# EAGLE board A20-SOM-EVB_Rev_F (EAGLE 4.16), part 1 of 3
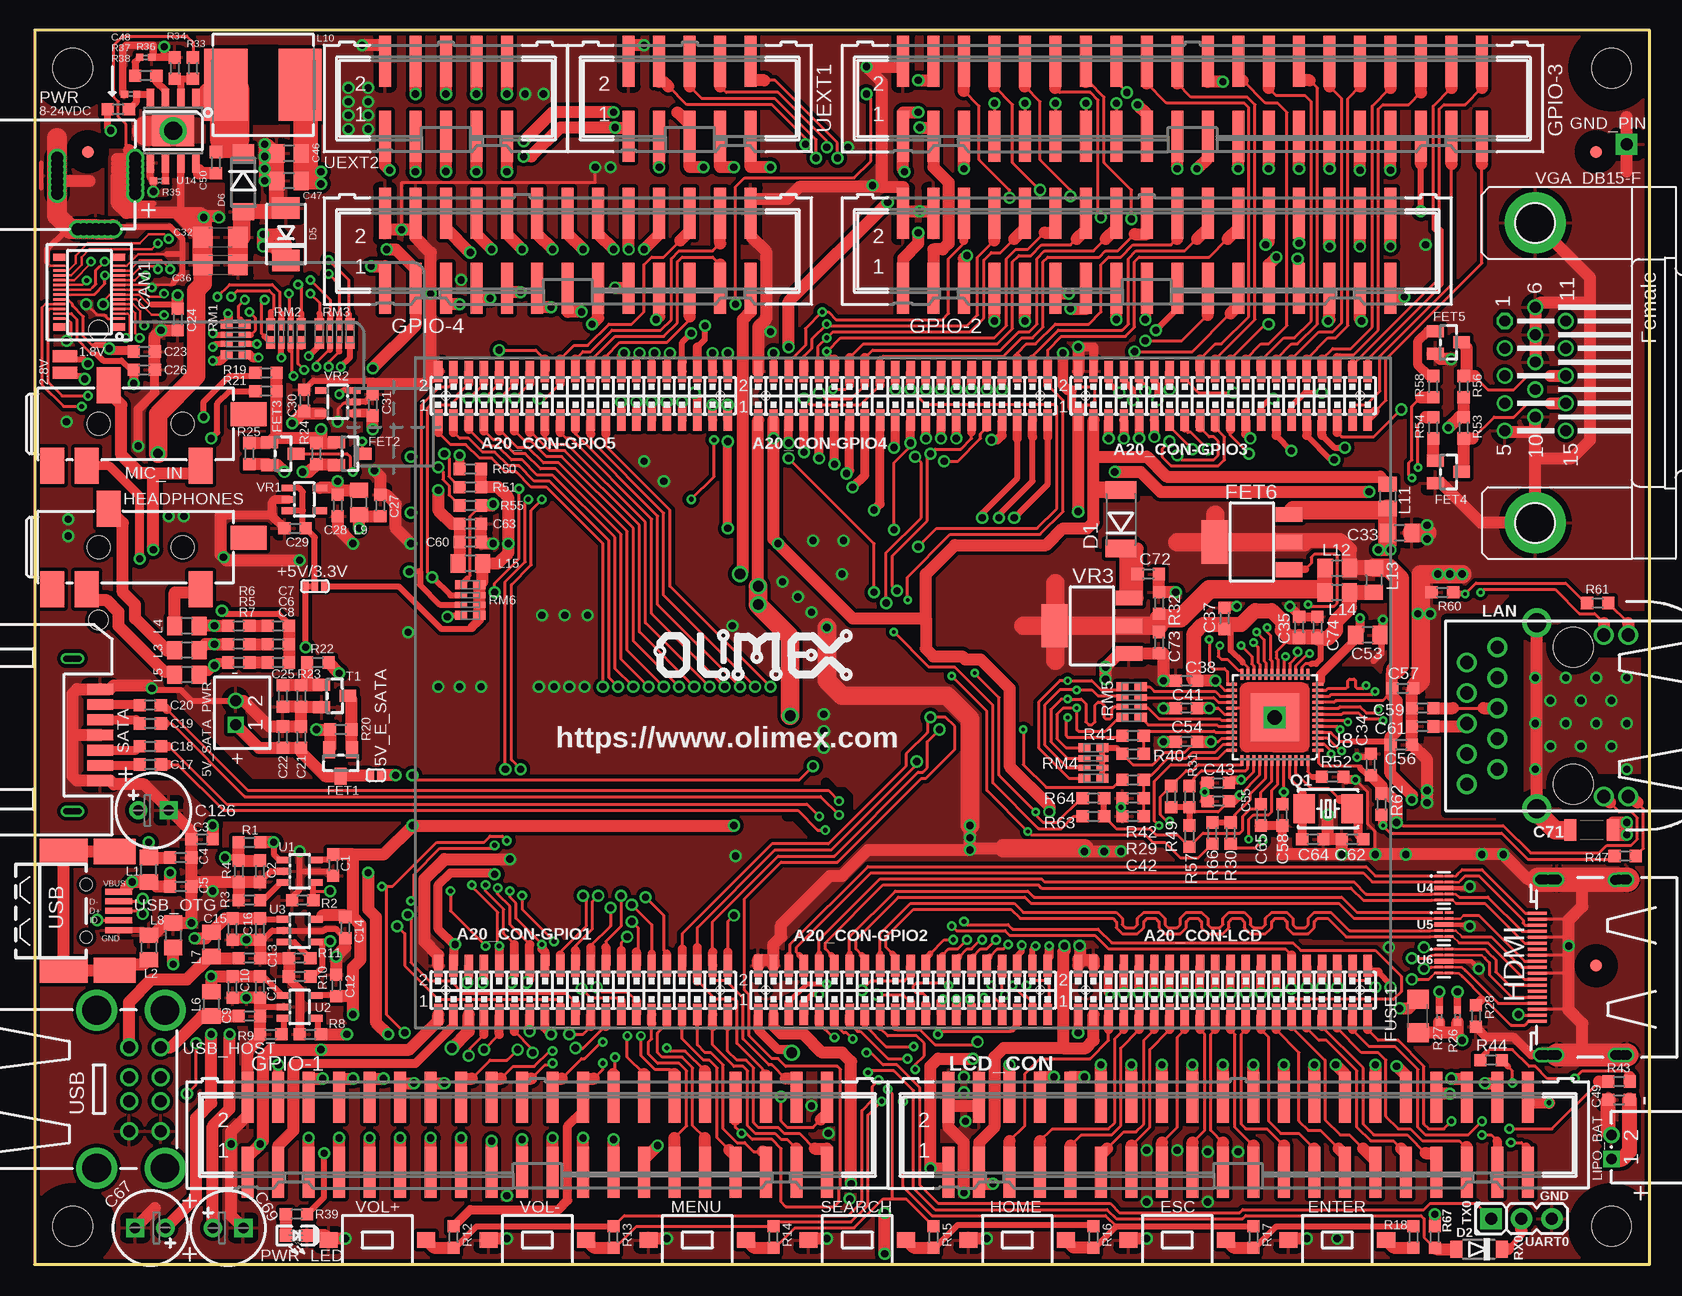
[diagram p5: board, top side]
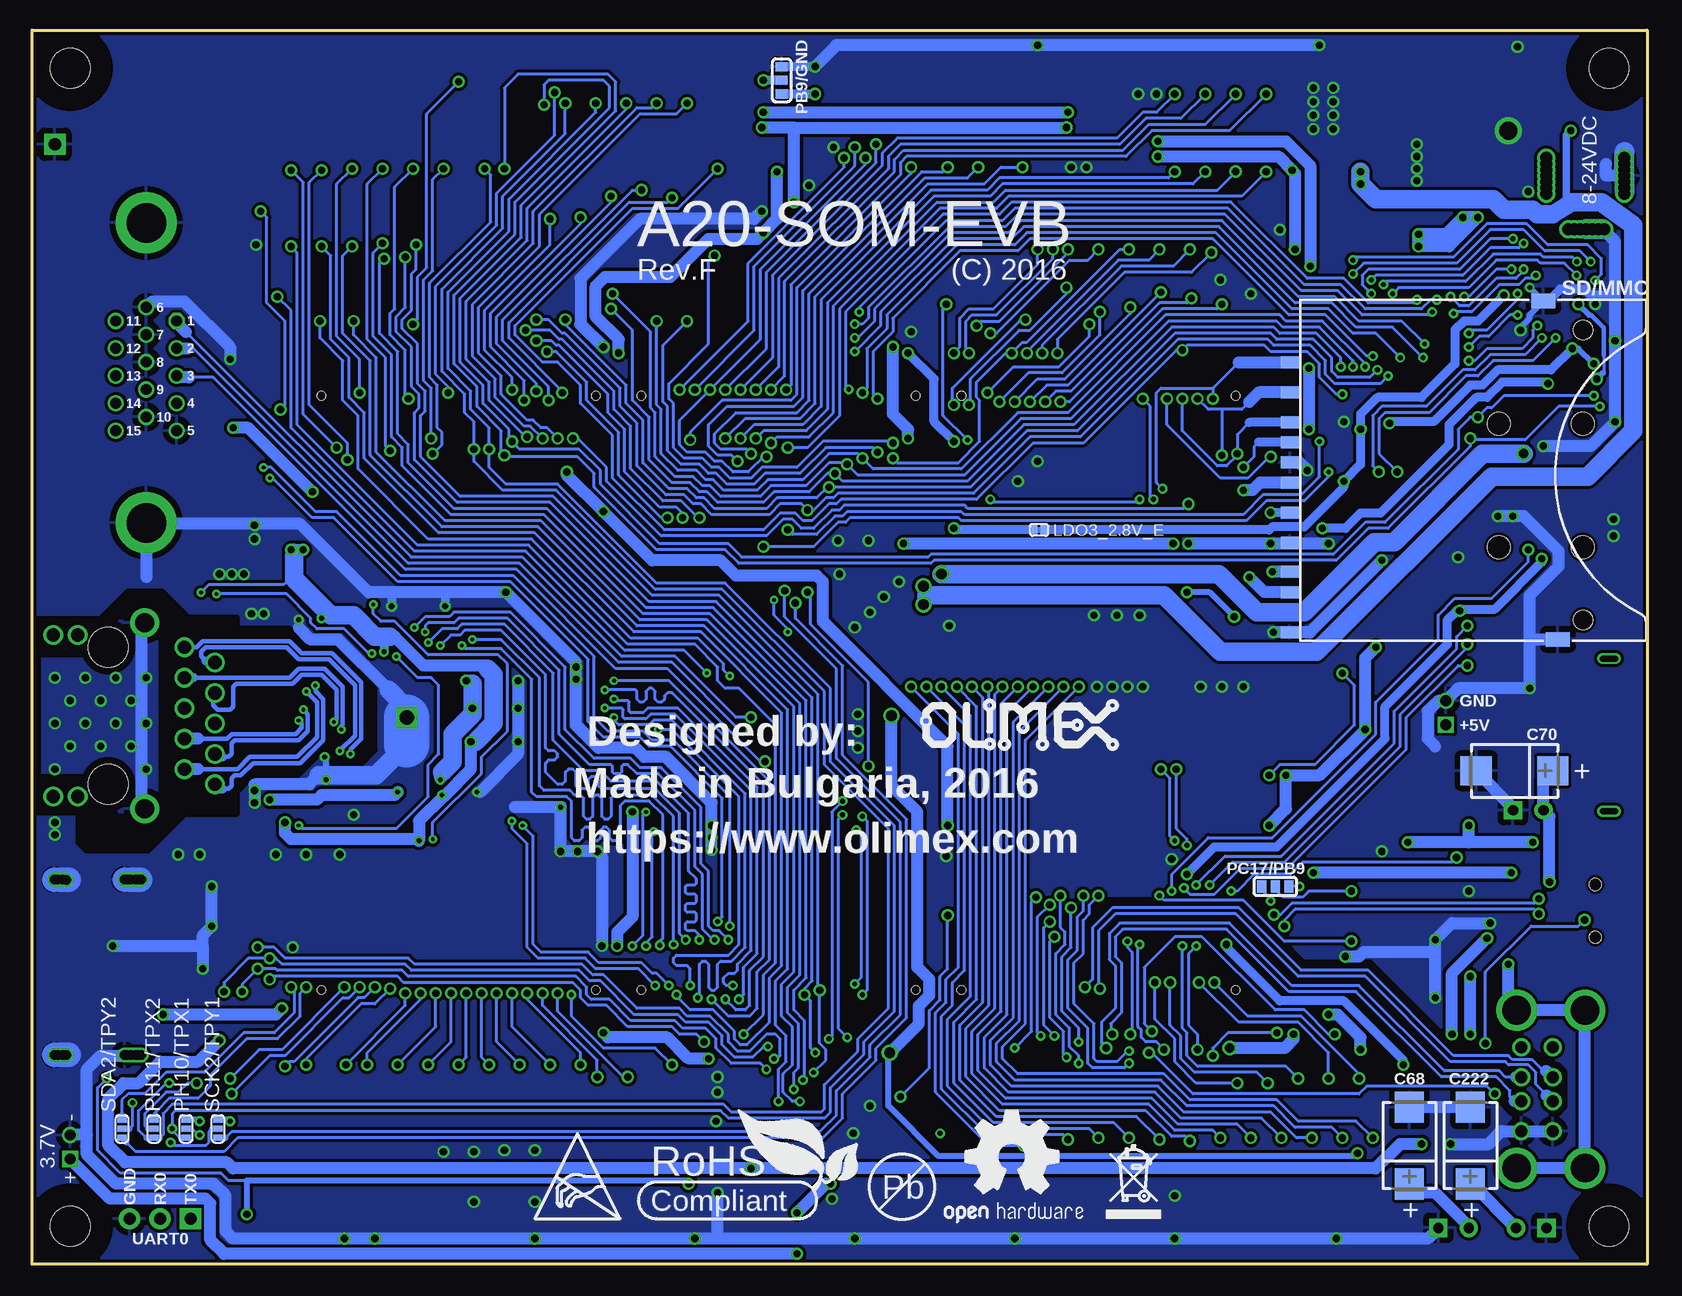
[diagram p6: board, bottom side, seen from below]

Size 134.62 x 102.87 mm. Coordinates in mm from the lower left corner, seen from the top.
Outline: 0,102.87 0,0 134.62,0 134.62,102.87 0,102.87
Copper layers (1+16): Top 0.035mm / dielectric 1.5mm / Bottom 0.035mm
Design rules "default": minimum track width 8mil, minimum drill 0.4mm, track to track 5mil, track to pad 5mil, pad to pad 5mil, via to via 5mil, smd to smd 1mil, copper to edge 10mil, drill to drill 8mil, minimum pad ring 8mil, minimum via ring 8mil, stop-mask expansion 4mil, vias tented up to drill 25mil, thermal gap 20mil
Holes 3.3 mm at 3.17,3.17 131.44,3.17 131.44,99.69 3.17,99.69
tRestrict: area 0,0 to 6.3,6.3; area 128.3,0 to 134.6,6.3; area 128.3,96.5 to 134.6,102.9; area 0,96.5 to 6.3,102.9; 51 lines
bRestrict: area 0,0 to 6.3,6.3; area 128.3,0 to 134.6,6.3; area 128.3,96.5 to 134.6,102.9; area 0,96.5 to 6.3,102.9; 43 lines

## Footprints (pad centres in the part's own frame; a part is rotated, then mirrored left to right if it is on the bottom)
SMD80/40 = smd 2.032 x 1.016: P$1 0,0
SJ_1_SMALLER = smd 0.508 x 0.762: 1 -0.381,0; 2 0.381,0
DW02S = drill 0.9 square: 1 -1,0 | drill 0.9 round: 2 1,0
SJ_2_SMALLER_23_TIED = smd 0.508 x 0.762: 1 -0.762,0; 2 0,0; 3 0.762,0
A20-SOM-EVB = smd 0.7 x 1.8: 1-1 -38.735,-26.797; 1-2 -38.735,-22.733; 1-3 -37.465,-26.797; 1-4 -37.465,-22.733; 1-5 -36.195,-26.797; 1-6 -36.195,-22.733; 1-7 -34.925,-26.797; 1-8 -34.925,-22.733; 1-9 -33.655,-26.797; 1-10 -33.655,-22.733; 1-11 -32.385,-26.797; 1-12 -32.385,-22.733; 1-13 -31.115,-26.797; 1-14 -31.115,-22.733; 1-15 -29.845,-26.797; 1-16 -29.845,-22.733; 1-17 -28.575,-26.797; 1-18 -28.575,-22.733; 1-19 -27.305,-26.797; 1-20 -27.305,-22.733; 1-21 -26.035,-26.797; 1-22 -26.035,-22.733; 1-23 -24.765,-26.797; 1-24 -24.765,-22.733; 1-25 -23.495,-26.797; 1-26 -23.495,-22.733; 1-27 -22.225,-26.797; 1-28 -22.225,-22.733; 1-29 -20.955,-26.797; 1-30 -20.955,-22.733; 1-31 -19.685,-26.797; 1-32 -19.685,-22.733; 1-33 -18.415,-26.797; 1-34 -18.415,-22.733; 1-35 -17.145,-26.797; 1-36 -17.145,-22.733; 1-37 -15.875,-26.797; 1-38 -15.875,-22.733; 1-39 -14.605,-26.797; 1-40 -14.605,-22.733; 2-1 -12.065,-26.797; 2-2 -12.065,-22.733; 2-3 -10.795,-26.797; 2-4 -10.795,-22.733; 2-5 -9.525,-26.797; 2-6 -9.525,-22.733; 2-7 -8.255,-26.797; 2-8 -8.255,-22.733; 2-9 -6.985,-26.797; 2-10 -6.985,-22.733; 2-11 -5.715,-26.797; 2-12 -5.715,-22.733; 2-13 -4.445,-26.797; 2-14 -4.445,-22.733; 2-15 -3.175,-26.797; 2-16 -3.175,-22.733; 2-17 -1.905,-26.797; 2-18 -1.905,-22.733; 2-19 -0.635,-26.797; 2-20 -0.635,-22.733; 2-21 0.635,-26.797; 2-22 0.635,-22.733; 2-23 1.905,-26.797; 2-24 1.905,-22.733; 2-25 3.175,-26.797; 2-26 3.175,-22.733; 2-27 4.445,-26.797; 2-28 4.445,-22.733; 2-29 5.715,-26.797; 2-30 5.715,-22.733; 2-31 6.985,-26.797; 2-32 6.985,-22.733; 2-33 8.255,-26.797; 2-34 8.255,-22.733; 2-35 9.525,-26.797; 2-36 9.525,-22.733; 2-37 10.795,-26.797; 2-38 10.795,-22.733; 2-39 12.065,-26.797; 2-40 12.065,-22.733; 3-1 14.605,22.733; 3-2 14.605,26.797; 3-3 15.875,22.733; 3-4 15.875,26.797; 3-5 17.145,22.733; 3-6 17.145,26.797; 3-7 18.415,22.733; 3-8 18.415,26.797; 3-9 19.685,22.733; 3-10 19.685,26.797; 3-11 20.955,22.733; 3-12 20.955,26.797; 3-13 22.225,22.733; 3-14 22.225,26.797; 3-15 23.495,22.733; 3-16 23.495,26.797; 3-17 24.765,22.733; 3-18 24.765,26.797; 3-19 26.035,22.733; 3-20 26.035,26.797; 3-21 27.305,22.733; 3-22 27.305,26.797; 3-23 28.575,22.733; 3-24 28.575,26.797; 3-25 29.845,22.733; 3-26 29.845,26.797; 3-27 31.115,22.733; 3-28 31.115,26.797; 3-29 32.385,22.733; 3-30 32.385,26.797; 3-31 33.655,22.733; 3-32 33.655,26.797; 3-33 34.925,22.733; 3-34 34.925,26.797; 3-35 36.195,22.733; 3-36 36.195,26.797; 3-37 37.465,22.733; 3-38 37.465,26.797; 3-39 38.735,22.733; 3-40 38.735,26.797; 4-1 -12.065,22.733; 4-2 -12.065,26.797; 4-3 -10.795,22.733; 4-4 -10.795,26.797; 4-5 -9.525,22.733; 4-6 -9.525,26.797; 4-7 -8.255,22.733; 4-8 -8.255,26.797; 4-9 -6.985,22.733; 4-10 -6.985,26.797; 4-11 -5.715,22.733; 4-12 -5.715,26.797; 4-13 -4.445,22.733; 4-14 -4.445,26.797; 4-15 -3.175,22.733; 4-16 -3.175,26.797; 4-17 -1.905,22.733; 4-18 -1.905,26.797; 4-19 -0.635,22.733; 4-20 -0.635,26.797; 4-21 0.635,22.733; 4-22 0.635,26.797; 4-23 1.905,22.733; 4-24 1.905,26.797; 4-25 3.175,22.733; 4-26 3.175,26.797; 4-27 4.445,22.733; 4-28 4.445,26.797; 4-29 5.715,22.733; 4-30 5.715,26.797; 4-31 6.985,22.733; 4-32 6.985,26.797; 4-33 8.255,22.733; 4-34 8.255,26.797; 4-35 9.525,22.733; 4-36 9.525,26.797; 4-37 10.795,22.733; 4-38 10.795,26.797; 4-39 12.065,22.733; 4-40 12.065,26.797; 5-1 -38.735,22.733; 5-2 -38.735,26.797; 5-3 -37.465,22.733; 5-4 -37.465,26.797; 5-5 -36.195,22.733; 5-6 -36.195,26.797; 5-7 -34.925,22.733; 5-8 -34.925,26.797; 5-9 -33.655,22.733; 5-10 -33.655,26.797; 5-11 -32.385,22.733; 5-12 -32.385,26.797; 5-13 -31.115,22.733; 5-14 -31.115,26.797; 5-15 -29.845,22.733; 5-16 -29.845,26.797; 5-17 -28.575,22.733; 5-18 -28.575,26.797; 5-19 -27.305,22.733; 5-20 -27.305,26.797; 5-21 -26.035,22.733; 5-22 -26.035,26.797; 5-23 -24.765,22.733; 5-24 -24.765,26.797; 5-25 -23.495,22.733; 5-26 -23.495,26.797; 5-27 -22.225,22.733; 5-28 -22.225,26.797; 5-29 -20.955,22.733; 5-30 -20.955,26.797; 5-31 -19.685,22.733; 5-32 -19.685,26.797; 5-33 -18.415,22.733; 5-34 -18.415,26.797; 5-35 -17.145,22.733; 5-36 -17.145,26.797; 5-37 -15.875,22.733; 5-38 -15.875,26.797; 5-39 -14.605,22.733; 5-40 -14.605,26.797; LCD-1 14.605,-26.797; LCD-2 14.605,-22.733; LCD-3 15.875,-26.797; LCD-4 15.875,-22.733; LCD-5 17.145,-26.797; LCD-6 17.145,-22.733; LCD-7 18.415,-26.797; LCD-8 18.415,-22.733; LCD-9 19.685,-26.797; LCD-10 19.685,-22.733; LCD-11 20.955,-26.797; LCD-12 20.955,-22.733; LCD-13 22.225,-26.797; LCD-14 22.225,-22.733; LCD-15 23.495,-26.797; LCD-16 23.495,-22.733; LCD-17 24.765,-26.797; LCD-18 24.765,-22.733; LCD-19 26.035,-26.797; LCD-20 26.035,-22.733; LCD-21 27.305,-26.797; LCD-22 27.305,-22.733; LCD-23 28.575,-26.797; LCD-24 28.575,-22.733; LCD-25 29.845,-26.797; LCD-26 29.845,-22.733; LCD-27 31.115,-26.797; LCD-28 31.115,-22.733; LCD-29 32.385,-26.797; LCD-30 32.385,-22.733; LCD-31 33.655,-26.797; LCD-32 33.655,-22.733; LCD-33 34.925,-26.797; LCD-34 34.925,-22.733; LCD-35 36.195,-26.797; LCD-36 36.195,-22.733; LCD-37 37.465,-26.797; LCD-38 37.465,-22.733; LCD-39 38.735,-26.797; LCD-40 38.735,-22.733 | hole 0.7: -38.1,-24.765; -15.24,-24.765; -11.43,24.765; 11.43,24.765; 15.24,24.765; 38.1,24.765; -11.43,-24.765; 11.43,-24.765; -38.1,24.765; -15.24,24.765; 15.24,-24.765; 38.1,-24.765
C0603_DWS = smd 1.016 x 1.016: 1 -0.889,0; 2 0.889,0
C1206_5MIL_WS = smd 1.651 x 1.778: 1 -1.46,0; 2 1.46,0
C0805_5MIL_DWS = smd 1.27 x 1.524: 1 -1.016,0; 2 1.016,0
E2,5-6,3 = drill 0.864 pad 1.524 round: + -1.27,0 | drill 0.864 pad 1.524 square: - 1.27,0
CT7343 = smd 2.6 x 2.4: + 3.2,0; - -3.2,0
C1206_5MILS_WS_ISO = smd 1.016 x 1.778: 1 -1.778,0; 2 1.778,0
CAM_2M_GT2005 = smd 0.2 x 1: 1 -2.2,-2.5; 2 -2.2,2.5; 3 -1.8,-2.5; 4 -1.8,2.5; 5 -1.4,-2.5; 6 -1.4,2.5; 7 -1,-2.5; 8 -1,2.5; 9 -0.6,-2.5; 10 -0.6,2.5; 11 -0.2,-2.5; 12 -0.2,2.5; 13 0.2,-2.5; 14 0.2,2.5; 15 0.6,-2.5; 16 0.6,2.5; 17 1,-2.5; 18 1,2.5; 19 1.4,-2.5; 20 1.4,2.5; 21 1.8,-2.5; 22 1.8,2.5; 23 2.2,-2.5; 24 2.2,2.5 | smd 0.6 x 1: MP1 -2.9,-2.5; MP2 -2.9,2.5; MP3 2.9,-2.5; MP4 2.9,2.5
MELF-MLL41 = smd 1.45 x 2.6: 1 -2.445,0; 2 2.445,0
SOD-123 = smd 1 x 1.4: A 1.9,0; C -1.9,0
DO214AA = smd 1.778 x 2.286: A 2.177,0; C -2.177,0
MLL-41 = smd 1.45 x 1.8: A 2.445,0; K -2.445,0
SW-TAKT_6X3.5_SMD = smd 1.27 x 1.524: P$1 0,4.064; P$2 0,-4.064
SOT23 = smd 1.4 x 1: 1 1.1,-0.95; 2 1.1,0.95; 3 -1.1,0
SOT223 = smd 2.235 x 1.219: 1 3.099,-2.311; 2 3.099,0; 3 3.099,2.311 | smd 2.2 x 3.6: 4 -3.099,0
FIDUCIAL-1X3 = smd 1 x 1: 1 0,0
1206 = smd 1.6 x 1.8: 1 -1.4,0; 2 1.4,0
TEST_PAD40/70/SQUARE = drill 1.016 pad 1.778 square: P$1 0,0
ML40-MALE(GBH-254-SMT-40) = smd 1 x 4.25: 1 -24.13,-3.125; 2 -24.13,3.125; 3 -21.59,-3.125; 4 -21.59,3.125; 5 -19.05,-3.125; 6 -19.05,3.125; 7 -16.51,-3.125; 8 -16.51,3.125; 9 -13.97,-3.125; 10 -13.97,3.125; 11 -11.43,-3.125; 12 -11.43,3.125; 13 -8.89,-3.125; 14 -8.89,3.125; 15 -6.35,-3.125; 16 -6.35,3.125; 17 -3.81,-3.125; 18 -3.81,3.125; 19 -1.27,-3.125; 20 -1.27,3.125; 21 1.27,-3.125; 22 1.27,3.125; 23 3.81,-3.125; 24 3.81,3.125; 25 6.35,-3.125; 26 6.35,3.125; 27 8.89,-3.125; 28 8.89,3.125; 29 11.43,-3.125; 30 11.43,3.125; 31 13.97,-3.125; 32 13.97,3.125; 33 16.51,-3.125; 34 16.51,3.125; 35 19.05,-3.125; 36 19.05,3.125; 37 21.59,-3.125; 38 21.59,3.125; 39 24.13,-3.125; 40 24.13,3.125
ML34-MALE(GBH-254-SMT-34) = smd 1 x 4.25: 1 -20.32,-3.125; 2 -20.32,3.125; 3 -17.78,-3.125; 4 -17.78,3.125; 5 -15.24,-3.125; 6 -15.24,3.125; 7 -12.7,-3.125; 8 -12.7,3.125; 9 -10.16,-3.125; 10 -10.16,3.125; 11 -7.62,-3.125; 12 -7.62,3.125; 13 -5.08,-3.125; 14 -5.08,3.125; 15 -2.54,-3.125; 16 -2.54,3.125; 17 0,-3.125; 18 0,3.125; 19 2.54,-3.125; 20 2.54,3.125; 21 5.08,-3.125; 22 5.08,3.125; 23 7.62,-3.125; 24 7.62,3.125; 25 10.16,-3.125; 26 10.16,3.125; 27 12.7,-3.125; 28 12.7,3.125; 29 15.24,-3.125; 30 15.24,3.125; 31 17.78,-3.125; 32 17.78,3.125; 33 20.32,-3.125; 34 20.32,3.125
ML26-MALE(GBH-254-SMT-26) = smd 1 x 4.25: 1 -15.24,-3.125; 2 -15.24,3.125; 3 -12.7,-3.125; 4 -12.7,3.125; 5 -10.16,-3.125; 6 -10.16,3.125; 7 -7.62,-3.125; 8 -7.62,3.125; 9 -5.08,-3.125; 10 -5.08,3.125; 11 -2.54,-3.125; 12 -2.54,3.125; 13 0,-3.125; 14 0,3.125; 15 2.54,-3.125; 16 2.54,3.125; 17 5.08,-3.125; 18 5.08,3.125; 19 7.62,-3.125; 20 7.62,3.125; 21 10.16,-3.125; 22 10.16,3.125; 23 12.7,-3.125; 24 12.7,3.125; 25 15.24,-3.125; 26 15.24,3.125
HDMI-SWM-19 = smd 0.25 x 1.6: 1 -4.5,-5.55; 2 -4,-5.55; 3 -3.5,-5.55; 4 -3,-5.55; 5 -2.5,-5.55; 6 -2,-5.55; 7 -1.5,-5.55; 8 -1,-5.55; 9 -0.5,-5.55; 10 0,-5.55; 11 0.5,-5.55; 12 1,-5.55; 13 1.5,-5.55; 14 2,-5.55; 15 2.5,-5.55; 16 3,-5.55; 17 3.5,-5.55; 18 4,-5.55; 19 4.5,-5.55 | drill 0.8 round: P$5 -7.3,-4.85; P$7 -7.3,1.25; P$9 7.3,1.25; P$11 7.3,-4.85; P$13 -7.3,-4.45; P$15 -7.3,1.65; P$18 7.3,1.65; P$20 7.3,-4.45; P$21 -7.3,-4.15; P$22 -7.3,-5; P$23 7.3,-5; P$24 7.3,-4.15; P$25 -7.3,-5.3; P$26 7.3,-5.3; P$27 7.3,0.95; P$28 -7.275,0.95; SH1 -7.3,-3.9; SH2 -7.3,1.95; SH3 7.3,1.95; SH4 7.3,-3.9
PJ-W47S-05D2-LF_5PIN_V2 = smd 2 x 3: 1 2.1,-0.5; 2 14.5,-0.5; 3 6.8,6.2; 5 5,-0.5 | smd 3 x 2: 4 18.5,3.8 | hole 1.9: 6,3; 13,3
L0805_5MIL_DWS = smd 1.27 x 1.524: 1 -1.016,0; 2 1.016,0
8X8MM_3131 = smd 3.6 x 6: 1 -3.1,0; 2 3.1,0
TM211Q01FM22_SH = drill 1.1 round: 1 -5.715,-6.35; 2 -4.445,-8.89; 3 -3.175,-6.35; 4 -1.905,-8.89; 5 -0.635,-6.35; 6 0.635,-8.89; 7 1.905,-6.35; 8 3.175,-8.89; 9 4.445,-6.35; 10 5.715,-8.89; 11 -6.731,2.54; 12 -6.731,4.572; 13 6.731,2.54; 14 6.731,4.572 | drill 1.6 round: SH1 -7.747,-3.048; SH2 7.747,-3.048 | hole 3.3: 5.715,0; -5.715,0
SJ_1_SMALLER_CLOSE = smd 0.508 x 0.762: 1 -0.381,0; 2 0.381,0
DW02R = drill 0.9 square: 1 -1,0 | drill 0.9 round: 2 1,0
SJ_2_SMALL = smd 0.762 x 1.016: 1 -1.143,0; 2 0,0; 3 1.143,0
SJ_2_SMALLER = smd 0.508 x 0.762: 1 -0.762,0; 2 0,0; 3 0.762,0
PWR_JACK_UNI_MILLING = drill 1 round: + 0,4.75; +1 0,5.25; +2 0,5.75; +3 0,6.25; +4 0,4.25; +5 0,3.75; +6 0,3.25; - -6.5,4.75; -1 -6.5,5.25; -2 -6.5,5.75; -3 -6.5,4.25; -4 -6.5,3.75; -5 -6.5,6.25; -6 -6.5,3.25; -- -3.3,0.3; --1 -3.8,0.3; --2 -4.3,0.3; --3 -4.8,0.3; --4 -2.8,0.3; --5 -2.3,0.3; --6 -1.8,0.3
LED-0603 = smd 1.016 x 1.016: A 0.889,0; C -0.889,0
HCX-4S = smd 1.8 x 2.4: 1 -2,0; 2 2,0
R0603_5MIL_DWS = smd 1.016 x 1.016: 1 -0.889,0; 2 0.889,0
R0402_TI = smd 0.61 x 0.584: 1 -0.508,0; 2 0.508,0
R_MATRIX_4 = smd 0.762 x 1.016: 1.1 -1.27,-0.762; 1.2 -1.27,0.762; 4.1 1.27,-0.762; 4.2 1.27,0.762 | smd 0.508 x 1.016: 2.1 -0.381,-0.762; 2.2 -0.381,0.762; 3.1 0.381,-0.762; 3.2 0.381,0.762
SATA-PWA-07 = smd 0.9 x 2.2: 1 -4.25,-4.8; 2 -2.98,-4.8; 3 -1.71,-4.8; 4 -0.44,-4.8; 5 0.83,-4.8; 6 2.1,-4.8; 7 3.37,-4.8 | drill 0.5 round: P$1 -6.81,-2.35; P$2 -6.81,-2.15; P$3 -6.81,-2.6; P$4 -6.81,-1.95; P$5 -6.81,-3; P$11 5.93,-2.35; P$20 5.93,-2.15; P$23 5.93,-2.6; P$24 5.93,-1.95; P$26 5.93,-3; SH1 -6.81,-2.8; SH4 5.93,-2.8
SD_CARD = smd 1.5 x 1: 1 -15.3,6.48; 2 -15.3,3.98; 3 -15.3,0.68; 4 -15.3,-1.03; 5 -15.3,-3.53; 6 -15.3,-6.03; 7 -15.3,-8.46; 8 -15.3,-10.16; 9 -15.3,8.98; CD -15.3,2.33; WP -15.3,-13.51 | smd 2 x 1.2: SH1 7.05,-14.1; SH2 5.85,14.1 | hole 1.6: 9.15,-12.49; 9.15,11.7
SOT23-5 = smd 1.2 x 0.55: 1 1.3,-0.95; 2 1.3,0; 3 1.3,0.95; 4 -1.3,0.95; 5 -1.3,-0.95
SLP2510P8 = smd 0.2 x 0.675: 1 -1,-0.438; 2 -0.5,-0.438; 4 0.5,-0.438; 5 1,-0.438; 6 1,0.438; 7 0.5,0.438; 9 -0.5,0.438; 10 -1,0.438 | smd 0.4 x 0.775: 3 0,-0.388; 8 0,0.388
QFN48_1DRILL(PADPITCH-0.5MM) = smd 0.25 x 0.9: 1 -2.75,-3.6; 2 -2.25,-3.6; 3 -1.75,-3.6; 4 -1.25,-3.6; 5 -0.75,-3.6; 6 -0.25,-3.6; 7 0.25,-3.6; 8 0.75,-3.6; 9 1.25,-3.6; 10 1.75,-3.6; 11 2.25,-3.6; 12 2.75,-3.6; 25 2.75,3.6; 26 2.25,3.6; 27 1.75,3.6; 28 1.25,3.6; 29 0.75,3.6; 30 0.25,3.6; 31 -0.25,3.6; 32 -0.75,3.6; 33 -1.25,3.6; 34 -1.75,3.6; 35 -2.25,3.6; 36 -2.75,3.6 | smd 0.9 x 0.25: 13 3.6,-2.75; 14 3.6,-2.25; 15 3.6,-1.75; 16 3.6,-1.25; 17 3.6,-0.75; 18 3.6,-0.25; 19 3.6,0.25; 20 3.6,0.75; 21 3.6,1.25; 22 3.6,1.75; 23 3.6,2.25; 24 3.6,2.75; 37 -3.6,2.75; 38 -3.6,2.25; 39 -3.6,1.75; 40 -3.6,1.25; 41 -3.6,0.75; 42 -3.6,0.25; 43 -3.6,-0.25; 44 -3.6,-0.75; 45 -3.6,-1.25; 46 -3.6,-1.75; 47 -3.6,-2.25; 48 -3.6,-2.75 | smd 4 x 4: EP 0,0 | drill 1.2 pad 1.422 square: N1 0,0
SOIC8E = smd 0.61 x 1.6: 1 -1.905,-2.7; 2 -0.635,-2.7; 3 0.635,-2.7; 4 1.905,-2.7; 5 1.905,2.7; 6 0.635,2.7; 7 -0.635,2.7; 8 -1.905,2.7 | smd 3.51 x 2.62: EP 0,0 | drill 1.5 round: EP1 0,0
HN1X3 = drill 1 pad 1.778 square: 1 -2.54,0 | drill 1 pad 1.778 round: 2 0,0; 3 2.54,0
ML10_S = smd 1 x 4.25: 1 -5.08,-3.125; 2 -5.08,3.125; 3 -2.54,-3.125; 4 -2.54,3.125; 5 0,-3.125; 6 0,3.125; 7 2.54,-3.125; 8 2.54,3.125; 9 5.08,-3.125; 10 5.08,3.125
USB_TWO_LEVEL = drill 1 round: 1.1 -3.5,2.62; 1.2 -1,2.62; 1.3 1,2.62; 1.4 3.5,2.62; 2.1 -3.5,0; 2.2 -1,0; 2.3 1,0; 2.4 3.5,0 | drill 2.4 round: GND1 -6.57,-2.7; GND2 6.57,-2.7; GND3 6.57,3; GND4 -6.57,3
USB_MINI_9PIN = smd 2.25 x 0.5: D+ -5.246,0; D- -5.246,-0.8; GND -5.246,1.6; ID -5.246,0.8; VBUS -5.246,-1.6 | smd 4 x 2.1: GND1 -0.64,-4.95; GND3 -0.64,4.95 | smd 3.5 x 2.1: GND2 -4.89,-4.95; GND4 -4.89,4.95 | hole 1: -2.54,-2.2; -2.54,2.2
DB15-F_22MM = drill 0.9 octagon: 1 4.329,6.35 | drill 0.9 round: 2 2.043,6.35; 3 -0.243,6.35; 4 -2.529,6.35; 5 -4.815,6.35; 6 5.472,3.81; 7 3.186,3.81; 8 0.9,3.81; 9 -1.386,3.81; 10 -3.672,3.81; 11 4.329,1.27; 12 2.043,1.27; 13 -0.243,1.27; 14 -2.529,1.27; 15 -4.815,1.27 | drill 3.302 pad 5.08 round: GND1 -12.497,3.81; GND2 12.497,3.81
SOT-23-5 = smd 1.2 x 0.55: 1 1.3,-0.95; 2 1.3,0; 3 1.3,0.95; 4 -1.3,0.95; 5 -1.3,-0.95

## Placement (x,y rotation side)
1.8V  TESTPAD80/40  [SMD80/40]  2.54,75.69 0 top
2.8V  TESTPAD80/40  [SMD80/40]  2.54,74.3 0 top
5V_E_SATA  [SJ_1_SMALLER]  28.45,40.77 180 top
5V_SATA_PWR  DW02S  [DW02S]  16.76,45.97 90 top
+5V/3.3V  [SJ_2_SMALLER_23_TIED]  23.37,56.52 180 top
A20-SOM-EVB_PLATFORM  6XGPH127SMT-02X20(PA-V16X-2X20-LF)  [A20-SOM-EVB]  72.39,47.62 0 top
C1  22uF/6.3V  [C0603_DWS]  24.89,33.27 270 top
C2  100nF  [C0603_DWS]  18.8,32.77 270 top
C3  22uF/6.3V  [C0603_DWS]  13.97,35.43 180 top
C4  22uF/6.3V  [C0603_DWS]  12.19,33.91 0 top
C5  100nF  [C0603_DWS]  12.19,31.5 0 top
C6  100nF  [C0603_DWS]  20.32,51.69 180 top
C7  100nF  [C0603_DWS]  20.32,53.21 180 top
C8  100nF  [C0603_DWS]  20.32,50.16 180 top
C9  100nF  [C0603_DWS]  17.91,20.7 0 top
C10  22uF/6.3V  [C0603_DWS]  16.51,23.11 270 top
C11  22uF/6.3V  [C0603_DWS]  18.8,23.11 270 top
C12  22uF/6.3V  [C0603_DWS]  25.15,23.24 90 top
C13  100nF  [C0603_DWS]  17.91,25.53 0 top
C14  22uF/6.3V  [C0603_DWS]  25.91,28.07 270 top
C15  22uF/6.3V  [C0603_DWS]  16.51,27.94 270 top
C16  22uF/6.3V  [C0603_DWS]  18.8,27.94 270 top
C17  10nF  [C0603_DWS]  9.65,41.66 180 top
C18  10nF  [C0603_DWS]  9.65,43.18 180 top
C19  10nF  [C0603_DWS]  9.65,45.09 180 top
C20  10nF  [C0603_DWS]  9.65,46.61 180 top
C21  22uF/6.3V  [C0603_DWS]  22.23,43.94 270 top
C22  NA(22uF/6.3V)  [C0603_DWS]  20.7,43.94 270 top
C23  100nF  [C0603_DWS]  9.14,76.07 0 top
C24  100nF  [C0603_DWS]  11.94,78.74 270 top
C25  22uF/6.3V  [C0603_DWS]  20.7,47.37 270 top
C26  100nF  [C0603_DWS]  9.14,74.55 0 top
C27  22uF/6.3V  [C0603_DWS]  28.83,63.25 90 top
C28  22uF/6.3V  [C0603_DWS]  25.27,63.25 270 top
C29  22uF/6.3V  [C0603_DWS]  21.72,61.34 180 top
C30  22uF/6.3V  [C0603_DWS]  22.48,72.01 90 top
C31  22uF/6.3V  [C0603_DWS]  28.19,71.63 90 top
C32  10uF/50V  [C1206_5MIL_WS]  15.49,85.6 0 top
C33  47uF/6.3V  [C0805_5MIL_DWS]  113.79,60.96 180 top
C34  100nF  [C0603_DWS]  111.38,41.66 270 top
C35  100nF  [C0603_DWS]  105.41,53.09 270 top
C36  NA(10uF/50V)  [C1206_5MIL_WS]  15.49,83.31 0 top
C37  22uF/6.3V  [C0603_DWS]  99.19,53.85 270 top
C38  100nF  [C0603_DWS]  96.01,48.64 0 top
C41  100nF  [C0603_DWS]  96.01,46.35 0 top
C42  NA  [C0603_DWS]  91.57,37.34 180 top
C43  100nF  [C0603_DWS]  98.68,40.13 0 top
C46  47uF/6.3V  [C0805_5MIL_DWS]  21.21,92.58 180 top
C47  47uF/6.3V  [C0805_5MIL_DWS]  21.21,90.3 180 top
C48  150pF  [C0603_DWS]  9.27,99.06 180 top
C49  22uF/6.3V  [C0603_DWS]  132.08,13.72 0 top
C50  100nF  [C0603_DWS]  15.11,91.82 90 top
C53  47uF/6.3V  [C0805_5MIL_DWS]  111.12,52.45 180 top
C54  100nF  [C0603_DWS]  96.01,43.56 0 top
C55  100nF  [C0603_DWS]  98.68,38.61 0 top
C56  22uF/6.3V  [C0603_DWS]  113.92,43.31 180 top
C57  100nF  [C0603_DWS]  114.05,48.01 180 top
C58  100nF  [C0603_DWS]  104.01,37.47 90 top
C59  100nF  [C0603_DWS]  115.7,46.35 0 top
C60  22uF/6.3V  [C0603_DWS]  36.32,60.2 180 top
C61  100nF  [C0603_DWS]  115.7,44.83 0 top
C62  27pF  [C0603_DWS]  109.86,35.43 0 top
C63  22uF/6.3V  [C0603_DWS]  36.32,61.72 180 top
C64  27pF  [C0603_DWS]  106.55,35.43 180 top
C65  NA(10uF/6.3V)  [C0603_DWS]  102.23,37.47 90 top
C67  100uF/16V/LOWESR/105C/6.3x11mm_RM2.5  [E2,5-6,3]  9.65,3.05 180 top
C68  NA(220uF/10V/tant)  [CT7343]  19.81,9.91 270 bottom
C69  100uF/16V/LOWESR/105C/6.3x11mm_RM2.5  [E2,5-6,3]  16.13,3.05 0 top
C70  NA(220uF/10V/tant)  [CT7343]  11.05,41.15 0 bottom
C71  1nF/2kV/X7R/1206  [C1206_5MILS_WS_ISO]  129.79,36.2 180 top
C72  22uF/6.3V  [C0603_DWS]  92.84,57.53 0 top
C73  22uF/6.3V  [C0603_DWS]  93.73,51.82 270 top
C74  22uF/6.3V  [C0603_DWS]  106.93,53.09 270 top
C126  100uF/16V/LOWESR/105C/6.3x11mm_RM2.5  [E2,5-6,3]  9.91,37.85 0 top
C222  NA(220uF/10V/tant)  [CT7343]  14.73,9.91 270 bottom
CAM1  CAMERA_2M-GT2005  [CAM_2M_GT2005]  4.57,81.03 90 top
D1  1N4007  [MELF-MLL41]  90.55,62.1 90 top
D2  1N5819(S4SOD-123)  [SOD-123]  120.4,1.27 180 top
D5  SMBJ26A  [DO214AA]  20.95,85.85 90 top
D6  1N5822/SS34/SMA  [MLL-41]  17.4,90.17 270 top
ENTER  SW-TAKT6  [SW-TAKT_6X3.5_SMD]  108.58,2.03 90 top
ESC  SW-TAKT6  [SW-TAKT_6X3.5_SMD]  95.25,2.03 90 top
FET1  IRLML6402  [SOT23]  25.53,41.78 90 top
FET2  BSS138  [SOT23]  26.29,67.56 180 top
FET3  BSS138  [SOT23]  20.7,67.56 180 top
FET4  BSS138  [SOT23]  117.86,66.04 180 top
FET5  BSS138  [SOT23]  117.86,76.83 180 top
FET6  NA(FDT434P)  [SOT223]  101.47,60.2 0 top
FID1  FIDUCIAL  [FIDUCIAL-1X3]  4.45,92.71 180 top
FID2  FIDUCIAL  [FIDUCIAL-1X3]  130.18,24.89 180 top
FID3  FIDUCIAL  [FIDUCIAL-1X3]  130.18,92.71 0 top
FUSE1  FSMD035  [1206]  115.32,20.7 90 top
GND_PIN  TESTPAD3  [TEST_PAD40/70/SQUARE]  132.72,93.34 0 top
GPIO-1  GPH254SMT2x20  [ML40-MALE(GBH-254-SMT-40)]  41.91,10.79 0 top
GPIO-2  GPH254SMT2x13  [ML34-MALE(GBH-254-SMT-34)]  92.71,84.45 0 top
GPIO-3  GPH254SMT2x20  [ML40-MALE(GBH-254-SMT-40)]  96.52,97.16 0 top
GPIO-4  ML26-(GBH-254-SMT-26)  [ML26-MALE(GBH-254-SMT-26)]  44.45,84.45 0 top
HDMI  HDMI-SWM-19  [HDMI-SWM-19]  130.81,24.77 270 top
HEADPHONES  PJ-W47S-05D2-LF_V2  [PJ-W47S-05D2-LF_5PIN_V2]  -0.64,56.77 0 top
HOME  SW-TAKT6  [SW-TAKT_6X3.5_SMD]  81.92,2.03 90 top
L1  FB0805/600R/2A  [L0805_5MIL_DWS]  9.53,32.89 90 top
L2  FB0805/600R/2A  [L0805_5MIL_DWS]  9.53,26.42 270 top
L3  FB0805/600R/2A  [L0805_5MIL_DWS]  12.7,51.18 180 top
L4  FB0805/600R/2A  [L0805_5MIL_DWS]  12.7,53.21 180 top
L5  FB0805/600R/2A  [L0805_5MIL_DWS]  12.7,49.15 180 top
L6  FB0805/600R/2A  [L0805_5MIL_DWS]  14.73,21.72 270 top
L7  FB0805/600R/2A  [L0805_5MIL_DWS]  14.73,26.67 270 top
L8  FB0805/600R/2A  [L0805_5MIL_DWS]  11.56,27.43 270 top
L9  FB0805/600R/2A  [L0805_5MIL_DWS]  27.05,63.5 90 top
L10  15uH/YS75  [8X8MM_3131]  19.05,98.3 0 top
L11  FB0805/600R/2A  [L0805_5MIL_DWS]  112.78,64.01 270 top
L12  FB0805/600R/2A  [L0805_5MIL_DWS]  108.58,58.04 0 top
L13  NA(FB0805/600R/2A)  [L0805_5MIL_DWS]  111.63,57.02 270 top
L14  FB0805/600R/2A  [L0805_5MIL_DWS]  108.58,56.01 0 top
L15  CL470nH/0805/0.3R/250mA  [L0805_5MIL_DWS]  36.32,58.42 180 top
LAN  TM211Q01FM22  [TM211Q01FM22_SH]  128.27,45.72 270 top
LCD_CON  GPH254SMT2x20  [ML40-MALE(GBH-254-SMT-40)]  100.33,10.79 0 top
LDO3_2.8V_E  Close  [SJ_1_SMALLER_CLOSE]  50.67,61.21 0 bottom
LIPO_BAT  DW02R  [DW02R]  131.44,9.78 90 top
MENU  SW-TAKT6  [SW-TAKT_6X3.5_SMD]  55.24,2.03 90 top
MIC_IN  PJ-W47S-05D2-LF_V2  [PJ-W47S-05D2-LF_5PIN_V2]  -0.64,67.06 0 top
PB9/GND  GND(close)  [SJ_2_SMALL]  72.14,98.68 270 bottom
PC17/PB9  PB9(close)  [SJ_2_SMALL]  30.99,31.5 180 bottom
PH10/TPX1  soldered-TPX1  [SJ_2_SMALLER]  121.79,11.3 270 bottom
PH11/TPX2  soldered-TPX2  [SJ_2_SMALLER]  124.46,11.3 270 bottom
PWR  YDJ-1136  [PWR_JACK_UNI_MILLING]  8.38,85.98 0 top
PWR_LED  LED/RED/0603  [LED-0603]  21.84,2.41 180 top
Q1  E4SB25.000F20E15(25MHz/20pF/20ppm/5x3.2mm)  [HCX-4S]  107.82,37.97 0 top
R1  4.99k/1%  [R0603_5MIL_DWS]  17.91,35.18 0 top
R2  10k  [R0603_5MIL_DWS]  22.35,30.35 0 top
R3  13k/1%  [R0603_5MIL_DWS]  17.91,30.35 0 top
R4  10k  [R0603_5MIL_DWS]  17.02,32.77 90 top
R5  22R  [R0603_5MIL_DWS]  17.02,51.69 180 top
R6  22R  [R0603_5MIL_DWS]  17.02,53.21 180 top
R7  22R  [R0603_5MIL_DWS]  17.02,50.16 180 top
R8  10k  [R0603_5MIL_DWS]  22.99,19.18 0 top
R9  6.81k/1%  [R0603_5MIL_DWS]  19.68,19.18 0 top
R10  10k  [R0603_5MIL_DWS]  22.1,24 0 top
R11  13k/1%  [R0603_5MIL_DWS]  22.1,25.53 0 top
R12  6.81k/1%  [R0603_5MIL_DWS]  34.92,2.29 270 top
R13  8.25k/1%  [R0603_5MIL_DWS]  48.26,2.29 270 top
R14  10k/1%  [R0603_5MIL_DWS]  61.59,2.29 270 top
R15  11k/1%  [R0603_5MIL_DWS]  74.93,2.29 270 top
R16  13k/1%  [R0603_5MIL_DWS]  88.27,2.29 270 top
R17  16.2k/1%  [R0603_5MIL_DWS]  101.6,2.29 270 top
R18  22.1k/1%  [R0603_5MIL_DWS]  114.94,2.29 270 top
R19  10k  [R0603_5MIL_DWS]  19.3,74.3 0 top
R20  10k  [R0603_5MIL_DWS]  25.53,44.58 0 top
R21  10k  [R0603_5MIL_DWS]  19.3,72.77 0 top
R22  10k  [R0603_5MIL_DWS]  23.62,50.16 0 top
R23  4.99k/1%  [R0603_5MIL_DWS]  22.23,47.37 90 top
R24  2.2k  [R0603_5MIL_DWS]  23.5,67.56 90 top
R25  2.2k  [R0603_5MIL_DWS]  17.91,67.56 90 top
R26  2k/1%  [R0402_TI]  118.62,20.7 270 top
R27  2k/1%  [R0402_TI]  117.09,20.7 270 top
R28  10k  [R0603_5MIL_DWS]  120.14,20.7 270 top
R29  1k  [R0603_5MIL_DWS]  91.57,38.86 180 top
R30  1k  [R0603_5MIL_DWS]  99.69,35.94 90 top
R31  10k  [R0603_5MIL_DWS]  96.27,38.99 90 top
R32  120R  [R0603_5MIL_DWS]  93.73,55.12 90 top
R33  NA(100k)  [R0603_5MIL_DWS]  13.21,99.69 270 top
R34  NA(47k)  [R0603_5MIL_DWS]  11.68,99.69 90 top
R35  100k  [R0402_TI]  10.41,90.3 180 top
R36  100k  [R0402_TI]  9.27,100.58 0 top
R37  2k/1%  [R0402_TI]  8,97.54 180 top
R38  11k/1%  [R0603_5MIL_DWS]  6.99,96.27 180 top
R39  2.2k  [R0603_5MIL_DWS]  21.84,4.19 180 top
R40  10k  [R0603_5MIL_DWS]  91.57,42.55 180 top
R41  22R  [R0603_5MIL_DWS]  91.57,44.07 180 top
R42  22R  [R0603_5MIL_DWS]  91.57,40.39 180 top
R43  2.2k  [R0603_5MIL_DWS]  132.08,15.24 180 top
R44  2.2k  [R0603_5MIL_DWS]  121.41,17.02 0 top
R47  1k  [R0603_5MIL_DWS]  132.59,34.04 0 top
R49  1k  [R0603_5MIL_DWS]  94.74,38.99 270 top
R50  10k  [R0603_5MIL_DWS]  36.32,66.29 0 top
R51  10k  [R0603_5MIL_DWS]  36.32,64.77 0 top
R52  12.1k/1%  [R0603_5MIL_DWS]  108.2,40.64 180 top
R53  390R  [R0603_5MIL_DWS]  119.13,69.72 270 top
R54  120R  [R0603_5MIL_DWS]  116.59,69.72 270 top
R55  1k  [R0603_5MIL_DWS]  36.32,63.25 0 top
R56  390R  [R0603_5MIL_DWS]  119.13,73.15 90 top
R57  NA  [R0603_5MIL_DWS]  96.27,35.69 270 top
R58  120R  [R0603_5MIL_DWS]  116.59,73.15 90 top
R60  1k  [R0603_5MIL_DWS]  117.35,56.01 180 top
R61  1k  [R0603_5MIL_DWS]  130.3,55.12 0 top
R62  1k  [R0603_5MIL_DWS]  112.27,38.35 90 top
R63  1k  [R0603_5MIL_DWS]  88.27,37.34 0 top
R64  NA  [R0603_5MIL_DWS]  88.27,38.86 0 top
R66  22R  [R0603_5MIL_DWS]  98.17,35.94 90 top
R67  NA  [R0603_5MIL_DWS]  116.71,2.29 90 top
RM1  RA1206_(4X0603)_4B8_22R  [R_MATRIX_4]  16.76,77.09 270 top
RM2  RA1206_(4X0603)_4B8_22R  [R_MATRIX_4]  20.95,77.6 180 top
RM3  RA1206_(4X0603)_4B8_22R  [R_MATRIX_4]  25.02,77.6 180 top
RM4  RA1206_(4X0603)_4B8_4.7k  [R_MATRIX_4]  88.27,41.78 270 top
RM5  RA1206_(4X0603)_4B8_22R  [R_MATRIX_4]  91.44,46.86 90 top
RM6  RA1206_(4X0603)_4B8_10k  [R_MATRIX_4]  36.32,55.37 270 top
SATA  SATA-PWA-07  [SATA-PWA-07]  0.68,44.56 90 top
SCK2/TPY1  soldered-TPY1  [SJ_2_SMALLER]  119.13,11.3 270 bottom
SD/MMC  PSD006A-LT2-BA0  [SD_CARD]  14.48,66.19 0 bottom
SDA2/TPY2  soldered-TPY2  [SJ_2_SMALLER]  127.13,11.3 270 bottom
SEARCH  SW-TAKT6  [SW-TAKT_6X3.5_SMD]  68.58,2.03 90 top
T1  BC846B  [SOT23]  25.02,47.37 180 top
U1  SY6280  [SOT23-5]  22.1,32.77 180 top
U2  SY6280  [SOT23-5]  22.1,21.46 180 top
U3  SY6280  [SOT23-5]  22.1,27.81 180 top
U4  NA(RCLAMP0524P)  [SLP2510P8]  117.47,31.37 270 top
U5  NA(RCLAMP0524P)  [SLP2510P8]  117.47,28.32 270 top
U6  NA(RCLAMP0524P)  [SLP2510P8]  117.47,25.27 270 top
U8  KSZ9031RNXCC/KSZ9031RNXICC  [QFN48_1DRILL(PADPITCH-0.5MM)]  103.38,45.59 90 top
U14  MP1584EN(SOIC8E)  [SOIC8E]  11.56,94.49 180 top
U$5  [LOGO-OPENHARDWARE_8X8]  52.96,8.89 0 bottom
U$6  [OLIMEX1_V]  42.88,42.7 0 bottom
U$8  [OLIMEX1_V]  69.34,48.51 0 top
U$9  [PB]  62.1,6.48 0 bottom
U$10  [ESD_SYMBOL]  92.71,3.81 0 bottom
U$11  [RECYCLE_BIN1/8]  45.09,3.81 0 bottom
U$12  [ROHS]  83.06,4.45 0 bottom
UART0  HN1X3  [HN1X3]  123.95,3.81 0 top
UEXT1  GBH-254-SMT-10  [ML10_S]  54.61,97.16 0 top
UEXT2  GBH-254-SMT-10  [ML10_S]  34.29,97.16 0 top
USB_HOST  USB_TWO_LEVEL  [USB_TWO_LEVEL]  7.87,14.61 270 top
USB_OTG  USB-OTG  [USB_MINI_9PIN]  1.78,29.46 180 top
VGA_DB15-F  VGA15  [DB15-F_22MM]  128.91,74.3 90 top
VOL+  SW-TAKT6  [SW-TAKT_6X3.5_SMD]  28.57,2.03 90 top
VOL-  SW-TAKT6  [SW-TAKT_6X3.5_SMD]  41.91,2.03 90 top
VR1  NA(AP1231-2.8V)  [SOT-23-5]  22.48,63.75 180 top
VR2  AP1231-1.8V(SOT23-5)  [SOT-23-5]  25.27,71.88 0 top
VR3  AMS1117  [SOT223]  88.14,53.21 0 top

## Tracks (layer width: path | path; a pad name or v marks a point on that pad's centre or on a via)
1.8V  (via drill 0.6)
  Top 0.203: 2.82,80.36 2.76,80.43 CAM1.10
  Top 0.254: 2.82,80.36 3.17,80.01 3.17,79.88 4.06,78.99 4.06,77.34 4.83,76.58 5.02,76.58
  Top 0.508: v6.22,76.33 5.97,76.58 5.02,76.58 | 1.8V.P$1 2.79,75.44 4.06,75.44 v4.45,75.06
  Top 0.762: v6.22,76.33 6.35,76.2 8.13,76.2 C23.1
  Top 1.016: v21.46,70.1 22.29,70.93 22.48,70.93 | 22.48,70.93 C30.1 | 22.48,70.93 VR2.5
  Bottom 0.508: v4.45,75.06 5.71,76.33 v6.22,76.33
  Bottom 0.762: v6.22,76.33 8,74.55 12.45,74.55 13.72,73.28 14.73,73.28 17.78,70.23 21.34,70.23 v21.46,70.1
1.25_EXT
  Top 1.016: 93.73,53.21 C73.1 | 93.73,53.85 R32.1
  Top 1.27: 107.57,56.26 L12.1 | 107.57,56.26 L14.1 | 106.81,56.26 107.57,56.26
  Top 1.524: 106.81,56.26 97.92,56.26 95.5,53.85 93.73,53.85 93.73,53.21 91.95,53.21 | 91.95,53.21 VR3.2 | 82.42,53.21 91.95,53.21 | 85.09,50.29 85.09,56.77
  pour Top (isolate 0.305, rank 2, no thermals): 92.84,61.34 92.84,51.18 90.68,51.18 83.44,43.94 79.38,43.94 79.38,50.42 73.91,50.42 73.91,57.53 77.72,61.34
2.8V  (via drill 0.6)
  Top 0.203: 9.78,80.01 9.53,80.01 8.71,80.83 CAM1.11 6.28,80.83 5.71,80.26 v5.71,80.01
  Top 0.508: 2.8V.P$1 2.79,74.04 3.94,74.04 v4.19,73.79 | 9.78,80.01 11.56,80.01 C24.1
  Top 1.016: 25.27,64.7 VR1.5 | 25.27,64.52 C28.1 | R25.2 19.54,68.45 FET3.1 19.92,68.83 20.19,68.83 | FET2.1 25.13,68.45 23.88,68.45 | 23.88,68.45 R24.2 | R19.2 R21.2 20.19,68.83 | 25.27,64.52 L9.2 | v25.27,65.28 25.27,64.7 | 25.27,64.7 25.27,64.52 | v23.88,69.6 23.88,68.83 | 23.88,68.83 23.88,68.45 | 23.88,68.83 20.19,68.83 | C24.1 v11.94,80.77
  Bottom 0.254: 3.68,74.3 3.56,74.42 3.56,75.69 3.62,75.75
  Bottom 0.381: 3.62,75.75 3.62,78.04 4.7,79.12 4.83,79.12
  Bottom 0.508: v4.19,73.79 3.68,74.3 | 4.83,79.12 v5.71,80.01 | 50.16,61.21 LDO3_2.8V_E.2
  Bottom 0.762: 50.16,61.21 31.5,61.21 31.24,61.47 28.57,61.47 25.27,64.77 v25.27,65.28 23.88,66.67 v23.88,69.6 23.88,70.87 22.48,72.26 18.8,72.26 16,75.06 16,77.85 15.24,78.61 14.1,78.61 v11.94,80.77
+5V  (via drill 0.6)
  Top 0.254: 86.36,72.9 86.36,73.15 88.14,73.15 88.39,72.9 88.39,72.01 88.01,71.63 86.49,71.63
  Top 0.508: U3.5 23.68,28.76 24,29.08 | 29.08,40.77 5V_E_SATA.1 | U1.5 24.45,33.72 C1.1 | C12.1 25.09,22.41 U2.5 | v22.61,51.44 +5V/3.3V.3 23.37,56.52
  Top 0.762: v87,19.3 A20-SOM-EVB_PLATFORM.LCD-1 | 86.11,72.9 86.36,72.9 86.49,72.77 86.49,71.63 86.49,71.37 87.12,71.37 87.12,70.99 87,70.99
  Top 0.889: v85.72,75.95 85.72,73.28 86.11,72.9
  Top 1.016: GPIO-1.1 17.78,9.02 v18.8,10.03 19.05,10.29 19.05,17.27 19.68,17.91 v23.88,17.91 31.24,17.91 33.66,20.32 A20-SOM-EVB_PLATFORM.1-1 | v40.77,93.6 43.18,96.01 v48.26,96.01 | v73.66,96.01 72.39,96.01 GPIO-3.1 72.39,91.19 v72.52,91.06 | GPIO-2.1 72.39,83.82 73.66,85.09 v73.66,85.98 | 87,70.99 A20-SOM-EVB_PLATFORM.3-1 v87,62.74 | R56.1 R53.1 118.75,70.61 v117.86,69.72 | 24,29.08 25.91,29.08 C14.1 26.54,28.96 | v26.54,20.83 26.54,22.35 | 26.54,22.35 C12.1 | 26.54,22.35 26.54,24.77 27.18,25.4 27.18,28.32 26.54,28.96 | v30.1,40.77 29.08,40.77 | FET1.2 24.64,42.94 R20.1 v23.5,44.58 | GPIO-4.1 29.21,83.19 v28.07,83.19 | v58.29,36.58 v31.5,36.58 29.08,34.16 26.54,34.16 | v90.04,66.04 92.2,66.04 93.85,64.39 v111.25,64.39 | v119,18.67 118.62,19.05 R26.2 118.62,19.3 117.09,19.3 | 26.54,28.96 26.54,34.16 | 26.54,34.16 C1.1 | LCD_CON.1 76.2,8 v74.68,8 74.68,16.51 75.31,17.14 v78.23,17.14 | FUSE1.1 117.09,19.3 | 117.09,19.3 R27.2
  Bottom 1.016: v87,19.3 86.61,18.92 81.66,18.92 79.88,17.14 v78.23,17.14 | v40.77,93.6 30.1,93.6 28.07,91.57 v28.07,83.19 | v73.66,96.01 v48.26,96.01 | v72.52,91.06 72.52,87.12 v73.66,85.98 74.17,85.47 78.23,85.47 81.41,82.3 86.87,82.3 87.63,81.53 87.63,78.99 85.72,77.09 v85.72,75.95 | v26.54,20.83 25.78,20.83 23.88,18.92 v23.88,17.91 | v31.5,36.58 30.1,37.97 v30.1,40.77 27.3,40.77 v23.5,44.58 23.5,50.55 v22.61,51.44 | v58.29,36.58 58.29,43.18 68.71,53.59 68.71,56.9 69.22,57.4 75.95,57.4 77.22,58.67 82.93,58.67 v87,62.74 90.04,65.79 v90.04,66.04 | v111.25,64.39 116.59,69.72 v117.86,69.72 | v18.8,10.03 20.57,10.03 22.61,8 v74.68,8 117.86,8 118.36,8.51 126.87,8.51 128.27,9.91 128.27,13.84 127,15.11 125.73,15.11 123.95,16.89 120.78,16.89 v119,18.67
+5V_OTG_PWR  (via drill 0.6, 0.8)
  Top 0.508: USB_OTG.VBUS 7.32,31.06 7.62,31.37
  Top 1.016: v34.8,18.03 36.2,19.43 A20-SOM-EVB_PLATFORM.1-5 | 7.62,31.37 v8.13,31.88 9.27,31.88 9.4,31.75 L1.1 9.78,31.88 10.16,31.5 C5.1 v11.3,32.64 | v29.46,19.18 28.45,20.19 28.45,28.96 27.81,29.59 v27.81,32.64
  Bottom 1.016: v29.46,19.18 29.46,18.8 30.23,18.03 v34.8,18.03 | v11.3,32.64 v27.81,32.64 | v8.13,31.88 8.13,37.34 C126.+ 8.64,40.36 C70.+
+12V  (via drill 0.6, 0.8, 0.9)
  Top 0.254: R33.1 13.21,101.85 12.7,102.36 7.37,102.36 6.6,101.6 6.6,97.28 6.99,96.9 6.99,95.63 7.62,95 7.62,93.14 7.75,93.02 7.87,92.89
  Top 0.508: 8.33,89.03 8.33,88.39 9.91,88.39
  Top 0.61: 12.19,87.63 U14.7
  Top 0.635: 7.77,92.99 | 7.77,92.99 7.75,93.02 | 8.38,92.13 8.38,92.38 7.77,92.99
  Top 1.016: GPIO-4.25 59.69,79.38 59.05,78.74 59.05,57.78 v58.8,57.53 | 6.86,89.08 6.86,88.39 7.62,87.63 7.7,87.63 | 6.86,89.08 6.86,89.71 | 6.86,89.71 6.86,90.73 PWR.+ | 12.57,87.63 13.84,87.63 14.1,87.38 | 12.57,87.63 12.19,87.63 11.94,87.63 | 11.94,87.63 11.81,87.63 | 11.81,87.63 8.46,87.63 | 8.46,87.63 7.7,87.63 | 8.33,89.03 8.33,90.55 | 6.86,89.71 8.38,89.71 | 6.86,89.08 8.38,89.08 | 7.7,87.63 7.7,89.15 | 8.46,87.63 8.46,89.15 | 6.86,91.11 8.38,91.11 | 6.86,91.36 8.38,91.36 | 6.86,91.75 8.38,91.75 | 6.86,92.13 8.38,92.13 | 7.87,92.89 8.38,92.38 | 14.03,85.53 11.94,87.63 | 12.57,87.63 14.16,86.04 | 11.81,87.63 14.16,85.28 | 20.95,83.69 D5.C | 20.95,83.69 19.81,84.84 v19.05,84.84 v19.05,85.85 20.19,85.85 20.95,85.09 20.95,83.69 | 14.1,87.38 15.24,87.38 v15.37,87.25 | 14.1,87.38 v14.1,87.25
  Top 1.524: v10.29,67.56 10.29,70.87 13.46,74.04 13.46,81.15 14.03,81.72 C36.1 | C32.1 14.03,87.19
  Top 1.651: C36.1 14.03,85.53 C32.1
  Bottom 1.016: v14.1,87.25 16.51,84.84 v19.05,84.84 v19.05,85.85 16.76,85.85 v15.37,87.25 v14.1,87.25
  Bottom 1.524: v10.29,67.56 13.72,67.56 21.08,60.2 22.73,60.2 28.57,54.36 32.51,54.36 35.69,57.53 v58.8,57.53
  pour Top (isolate 0.254, rank 3): 8.89,92.84 6.22,92.84 6.22,87.5 11.3,87.5 12.83,85.98 12.83,82.42 15.37,82.42 15.37,87 15.75,87 15.75,90.04 13.34,90.04 12.45,90.93 11.94,90.93 11.56,90.55 11.56,88.77 11.3,88.52 9.27,88.52 8.89,88.9
+15V  (via drill 0.6, 0.9)
  Top 0.508: R39.1 24.13,5.59 v24.13,9.27
  Top 0.584: v6.35,94.49 6.1,94.74 R38.2
  Top 0.762: A20-SOM-EVB_PLATFORM.2-1 60.33,19.56 61.98,17.91 62.87,17.91 v63.12,17.65
  Top 1.016: v60.33,56.52 A20-SOM-EVB_PLATFORM.4-1 | C46.1 22.61,92.58 23.11,92.58 | C47.1 22.48,90.55 | C47.1 22.61,90.68 | C47.1 22.48,90.04 v23.88,90.04 | v23.88,91.06 22.73,91.06
  Top 1.27: 22.23,98.17 22.23,100.58
  Top 1.524: v60.33,56.52 v60.33,54.99 62.99,52.32 v62.99,45.72
  Top 2.032: L10.2 22.1,98.3 22.23,98.17 22.61,97.79 22.61,92.58 22.61,90.68
  Bottom 0.508: v24.13,9.27 24.38,9.02 59.05,9.02 63.25,13.21 63.25,17.53 v63.12,17.65
  Bottom 0.61: 6.22,88.52 6.73,89.03 6.73,94.11 v6.35,94.49
  Bottom 1.016: v63.12,17.65 60.71,20.07 60.71,21.54 59.82,22.43 59.82,23.75 60.83,24.77 60.83,37.72 62.99,39.88 v62.99,45.72 | v60.33,56.52 60.33,55.75 | 60.33,55.75 60.07,55.75 | v60.33,54.99 60.33,55.75
  Bottom 1.524: 60.07,55.75 40.26,55.75 35.56,51.05 27.56,51.05 12.95,65.66 4.95,65.66 1.14,69.47 1.14,86.61 3.81,88.52 6.22,88.52 7.87,87.5 9.14,87.5 9.53,87.88 11.94,87.88 12.83,88.77 22.61,88.77 v23.88,90.04 v23.88,91.06
+24V  (via drill 0.6)
  Top 0.889: A20-SOM-EVB_PLATFORM.2-3 61.59,19.81 62.23,19.18 64.14,19.18
  Top 1.016: 64.14,19.18 65.66,17.65 67.31,17.65 68.07,16.89 v68.07,6.73 | v70.87,0.89 v70.87,4.32
  Top 1.27: C49.2 132.97,9.41 132.33,8.78 LIPO_BAT.1
  Bottom 1.016: LIPO_BAT.1 128.14,5.48 120.16,5.48 119.76,5.08 119.76,2.03 118.62,0.89 v70.87,0.89 | v70.87,4.32 68.45,6.73 v68.07,6.73
AVDD1  (via drill 0.6)
  Top 0.203: 3.07,79.23 CAM1.4
  Top 0.254: 3.07,79.23 3.56,78.74 3.56,77.09 4.7,75.95 5.08,75.95 5.21,75.82
  Top 0.508: 5.21,75.82 5.71,75.31 7.24,75.31 8,74.55 C26.1
  Top 0.762: C26.1 v8.26,73.41
  Top 1.016: 27.05,62.36 C27.1 | v27.05,61.34 27.05,62.36 | 27.05,62.36 L9.1
  Bottom 0.762: v27.05,61.34 25.15,61.34 23.88,62.61 22.23,62.61 16.51,68.33 16.51,69.98 14.22,72.26 13.34,72.26 12.06,73.53 8.38,73.53 v8.26,73.41
AVDDL(1.2)  (via drill 0.4, 0.6)
  Top 0.254: U8.4 107,44.32 108.08,44.32 108.84,43.56 109.86,43.56 | U8.9 108.31,46.84 108.46,46.99 112.39,46.99 112.78,47.37 113.16,47.37 | U8.44 104.13,39.38 v104.14,39.37
  Top 0.406: C58.2 104.14,38.48 v104.14,39.37
  Top 0.508: C56.2 113.03,43.56 109.86,43.56
  Top 1.016: 113.03,43.56 113.03,43.94 113.54,44.45 113.54,46.99 113.16,47.37 C57.2 113.16,49.28 113.41,49.53 | C56.2 113.03,40.89 114.81,39.12 v114.81,38.73
  Top 1.27: L13.1 L12.2 109.6,59.56 108.84,60.33 105.92,60.33 105.79,60.2
  Top 1.524: L13.1 112.9,58.04 113.79,57.15 113.79,49.91 113.41,49.53 | 105.79,60.2 FET6.2 98.42,60.2 | 98.42,60.2 95.25,60.2 | 98.42,60.2 98.42,62.48
  Bottom 1.016: v104.14,39.37 104.39,39.12 110.49,39.12 110.87,38.73 v114.81,38.73
  pour Top (isolate 0.305, no thermals): 88.77,63.88 88.77,59.82 92.46,56.13 111.63,56.13 111.63,65.91 107.7,65.91 107.7,63.88
CLK125  (via drill 0.3, 0.4, 0.6)
  Top 0.254: R66.1 97.03,33.91 95.5,33.91 94.23,35.18 93.22,35.18 92.58,35.81 83.06,35.81 v82.8,36.07 79.38,39.5 79.38,46.1 v76.45,49.02
  Top 0.508: A20-SOM-EVB_PLATFORM.2-38 83.19,26.29 v83.44,26.54
  Top 1.016: v110.62,78.61 110.49,78.74 GPIO-2.31
  Bottom 0.254: v82.8,36.07 82.93,35.94 82.93,27.3 83.44,26.8 v83.44,26.54 | v110.62,78.61 110.62,77.22 108.71,75.31 108.71,72.01 107.44,70.74 107.44,66.29 101.6,60.45 92.96,60.45 84.71,52.2 79.12,52.2 76.96,50.04 76.96,49.53 v76.45,49.02
DVDDL(1.2)  (via drill 0.4, 0.6)
  Top 0.254: U8.14 105.63,49.75 105.92,50.04 106.43,50.04 | U8.18 103.63,50.42 103.5,50.55 103.5,51.05 104.52,52.07 104.52,52.32 | U8.23 101.13,49.75 100.71,50.16 | U8.39 101.63,41.05 100.97,40.39 v100.58,40.39 | U8.30 99.19,45.84 98.68,46.35 v97.92,46.35 | U8.26 99.22,47.84 v98.42,48.64
  Top 0.508: 106.43,50.04 106.81,50.04 107.19,50.42 107.19,52.2 | C37.2 99.69,52.96 99.69,51.18 100.71,50.16
  Top 0.762: C43.2 99.82,40.39 v100.58,40.39 | 99.19,53.34 C37.2
  Top 1.016: v98.42,48.64 C38.2 96.77,48.64 96.65,48.77 | 105.41,52.32 C35.2 | v97.92,46.35 C41.2
  Top 1.27: L13.2 L14.2 109.6,54.74 108.46,53.59 108.46,52.83 107.82,52.2 107.19,52.2 C74.2 106.93,52.32 105.41,52.32 104.52,52.32 104.01,52.83 104.01,53.59 103.12,54.48 101.73,54.48 100.58,53.34 99.19,53.34 97.41,53.34 96.65,52.58 96.65,48.77
  Bottom 0.508: v100.58,40.39 100.58,40.51
  Bottom 1.016: 97.92,48.39 97.92,48.64 v98.42,48.64 | 100.58,40.51 100.58,40.89 100.46,41.02
  Bottom 1.524: 97.92,48.39 v97.92,46.35 97.92,45.85 99.57,44.2 99.57,41.91 100.46,41.02
EMDC  (via drill 0.3, 0.4)
  Top 0.254: 83.19,21.84 82.68,22.35 82.42,22.35 v81.53,23.24 | U8.36 99.36,42.84 98.68,42.16 96.77,42.16 96.27,41.66 94.74,41.66 93.34,40.26 93.34,36.96 v93.73,36.58
  Top 0.508: A20-SOM-EVB_PLATFORM.2-37 83.19,21.84
  Bottom 0.254: v81.53,23.24 82.55,24.26 82.93,24.26 83.82,25.15 87.38,25.15 88.27,26.04 92.2,26.04 92.84,26.67 92.84,35.69 v93.73,36.58
EMDIO  (via drill 0.3, 0.4)
  Top 0.254: 84.45,21.84 84.58,21.97 84.58,23.24 84.2,23.62 83.06,23.62 v82.68,23.24 | U8.37 100.63,41.66 97.03,41.66 96.52,41.15 96.01,41.15 R49.1 93.85,38.99 93.85,37.47 94.36,36.96 v94.61,36.96
  Top 0.508: A20-SOM-EVB_PLATFORM.2-39 84.45,21.84
  Bottom 0.254: v82.68,23.24 84.07,24.64 87.63,24.64 88.52,25.53 92.46,25.53 93.34,26.42 93.34,35.05 94.61,36.32 v94.61,36.96
ENTER_BUT
  Top 1.016: ENTER.P$2 113.28,1.4 R18.2
EPHY-RST#  (via drill 0.3, 0.4, 0.6)
  Top 0.254: R64.1 87.25,38.86 85.22,36.83 84.07,36.83 83.44,37.47 v83.44,37.72 80.39,40.77 80.39,47.24 v78.36,49.28
  Top 0.762: A20-SOM-EVB_PLATFORM.2-40 84.45,25.65 84.58,25.65 v84.58,26.54
  Top 1.016: GPIO-2.33 113.03,80.64 v114.17,80.64
  Bottom 0.254: v114.17,80.64 113.03,79.5 113.03,69.72 102.74,59.44 93.47,59.44 85.22,51.18 80.26,51.18 v78.36,49.28 | v84.58,26.54 83.69,27.43 83.69,37.47 v83.44,37.72
ERXCK  (via drill 0.3, 0.4)
  Top 0.254: 80.64,21.59 80.01,22.23 80.01,22.99 v79.76,23.24 | R42.2 90.55,40.39 89.92,39.75 84.33,39.75 82.42,41.66 v82.42,44.58
  Top 0.508: A20-SOM-EVB_PLATFORM.2-33 80.64,21.59
  Bottom 0.254: v79.76,23.24 79.76,24.64 80.01,24.89 80.9,24.89 81.15,25.15 81.15,25.53 80.9,25.78 76.58,25.78 75.69,26.67 75.69,38.99 81.28,44.58 v82.42,44.58
ERXD0  (via drill 0.3, 0.4)
  Top 0.254: 74.3,21.72 74.3,22.35 74.04,22.61 73.53,22.61 73.28,22.86 73.28,23.24 73.53,23.5 75.95,23.5 v76.2,23.24 | RM5.1.2 90.42,45.59 89.28,44.45 87,44.45 86.87,44.58 v86.87,46.35 85.72,46.35 85.22,45.85 85.22,43.81 85.98,43.05 RM4.1.1
  Top 0.762: 74.3,21.72 A20-SOM-EVB_PLATFORM.2-23
  Bottom 0.254: v76.2,23.24 76.71,23.24 76.96,23.5 76.96,23.88 76.58,24.26 76.07,24.26 75.82,24.51 75.82,25.02 74.68,26.16 74.68,39.5 81.03,45.85 83.06,45.85 83.44,45.47 85.22,45.47 85.34,45.59 85.34,46.23 85.47,46.35 v86.87,46.35
ERXD1  (via drill 0.3, 0.4)
  Top 0.254: RM5.2.2 90.04,46.48 89.79,46.23 89.79,45.59 89.66,45.47 89.28,45.47 89.15,45.59 89.15,46.61 88.9,46.86 88.65,46.86 88.39,46.61 88.39,45.21 88.14,44.96 87.88,44.96 87.63,45.21 87.63,46.74 87.25,47.12 v86.11,47.12 85.6,47.12 84.71,46.23 84.71,43.56 86.11,42.16 RM4.2.1
  Top 0.762: A20-SOM-EVB_PLATFORM.2-25 75.56,21.97 v75.69,22.1
  Bottom 0.254: v75.69,22.1 75.31,22.48 75.31,24.77 74.17,25.91 74.17,39.75 80.77,46.35 83.31,46.35 83.69,45.97 84.71,45.97 84.84,46.1 84.84,46.86 84.96,46.99 85.98,46.99 v86.11,47.12
ERXD2  (via drill 0.3, 0.4)
  Top 0.254: RM5.3.2 90.55,47.37 88.65,47.37 88.14,47.88 v86.87,47.88 85.47,47.88 84.2,46.61 84.2,43.31 86.11,41.4 RM4.3.1
  Top 0.762: v76.83,22.1 A20-SOM-EVB_PLATFORM.2-27
  Bottom 0.254: v76.83,22.1 75.95,21.21 75.18,21.21 74.8,21.59 74.8,24.51 73.66,25.65 73.66,40.01 81.28,47.62 81.66,47.62 81.92,47.37 81.92,47.12 82.17,46.86 82.42,46.86 82.68,47.12 82.68,47.75 82.93,48.01 83.19,48.01 83.44,47.75 83.44,47.12 83.69,46.86 83.95,46.86 84.2,47.12 84.2,47.75 84.33,47.88 v86.87,47.88
ERXD3  (via drill 0.3, 0.4)
  Top 0.254: RM5.4.2 90.42,47.88 88.9,47.88 88.14,48.64 v86.11,48.64 85.47,48.64 83.69,46.86 83.69,43.05 86.23,40.51 RM4.4.1
  Top 0.508: v77.98,22.1 78.11,21.97 A20-SOM-EVB_PLATFORM.2-29
  Bottom 0.254: v77.98,22.1 76.58,20.7 74.8,20.7 74.17,21.34 74.17,24.38 73.15,25.4 73.15,40.26 81.53,48.64 v86.11,48.64
ERXDV  (via drill 0.3, 0.4)
  Top 0.254: R41.2 90.55,43.94 86.11,43.94 85.98,44.07 85.98,45.47 v86.11,45.59
  Top 0.508: A20-SOM-EVB_PLATFORM.2-31 79.38,21.97 v79.12,22.23
  Bottom 0.254: v79.12,22.23 78.99,22.35 78.99,25.02 78.74,25.27 78.49,25.27 78.23,25.02 78.23,23.11 77.98,22.86 77.72,22.86 77.47,23.11 77.47,25.02 77.22,25.27 76.33,25.27 75.18,26.42 75.18,39.24 81.28,45.34 82.8,45.34 83.19,44.96 85.72,44.96 86.11,45.34 v86.11,45.59
ESC_BUT
  Top 0.508: R17.2 101.73,1.4 103.5,3.17 R18.1
  Top 1.016: ESC.P$2 99.95,1.4 R17.2
ETXCK  (via drill 0.3, 0.4)
  Top 0.254: U8.24 100.63,49.53 100.33,49.53 99.44,50.42 98.93,50.42 98.68,50.67 98.68,51.44 v98.81,51.56
  Top 0.508: v82.3,26.61 82.3,26.1 81.92,25.72 A20-SOM-EVB_PLATFORM.2-36
  Bottom 0.254: v82.3,26.61 82.3,26.92 82.04,27.18 82.04,37.47 83.19,38.61 85.22,38.61 85.6,38.23 85.6,35.56 85.85,35.31 86.23,35.31 86.49,35.56 86.49,36.2 86.74,36.45 87,36.45 87.25,36.2 87.25,35.56 87.5,35.31 87.76,35.31 88.01,35.56 88.01,36.2 88.27,36.45 88.52,36.45 88.77,36.2 88.77,35.56 89.03,35.31 89.41,35.31 89.66,35.56 89.66,38.61 90.04,38.99 92.58,38.99 92.96,39.37 92.96,48.77 95.5,51.31 98.55,51.31 v98.81,51.56
ETXD0  (via drill 0.3, 0.4)
  Top 0.254: 74.68,25.91 75.82,27.05 v76.58,27.05 | U8.19 103.13,50.29 103,50.42 103,52.45 102.74,52.7 v102.74,53.09
  Top 0.508: A20-SOM-EVB_PLATFORM.2-24 74.3,25.53 74.68,25.91
  Bottom 0.254: v76.58,27.05 77.34,27.81 77.85,27.81 78.23,28.19 78.23,32.77 78.87,33.4 78.87,38.1 82.17,41.4 83.95,41.4 84.71,42.16 87.76,42.16 90.17,44.58 90.17,49.78 94.74,54.36 99.44,54.36 99.82,53.98 101.85,53.98 v102.74,53.09
ETXD1  (via drill 0.3, 0.4)
  Top 0.254: 75.69,25.78 76.2,26.29 76.96,26.29 v77.72,27.05 | U8.20 102.63,50.15 102.49,50.29 102.49,52.07 v101.85,52.7
  Top 0.508: A20-SOM-EVB_PLATFORM.2-26 75.56,25.65 75.69,25.78
  Bottom 0.254: v77.72,27.05 77.85,27.05 78.74,27.94 78.74,32.51 79.38,33.15 79.38,37.85 82.42,40.89 84.2,40.89 84.96,41.66 85.34,41.66 85.47,41.53 85.47,41.02 85.6,40.89 86.11,40.89 86.23,41.02 86.23,41.53 86.36,41.66 88.14,41.66 90.68,44.2 90.68,49.53 95,53.85 99.06,53.85 99.44,53.47 101.6,53.47 101.85,53.21 v101.85,52.7
ETXD2  (via drill 0.3, 0.4)
  Top 0.254: 77.09,25.65 77.72,26.29 78.11,26.29 78.87,27.05 v78.99,27.05 | U8.21 102.13,50.02 101.98,50.16 101.98,51.44 v101.6,51.82
  Top 0.508: A20-SOM-EVB_PLATFORM.2-28 76.83,25.4 77.09,25.65
  Bottom 0.254: v78.99,27.05 78.99,27.43 79.38,27.81 80.01,27.81 80.14,27.94 80.14,28.45 80.01,28.57 79.38,28.57 79.25,28.7 79.25,29.21 79.38,29.34 80.01,29.34 80.14,29.46 80.14,29.97 80.01,30.1 79.38,30.1 79.25,30.23 79.25,30.73 79.38,30.86 80.01,30.86 80.14,30.99 80.14,31.5 80.01,31.62 79.38,31.62 79.25,31.75 79.25,32.13 79.88,32.77 79.88,37.59 82.55,40.26 86.36,40.26 87.25,41.15 88.65,41.15 91.19,43.69 91.19,49.28 95.25,53.34 98.81,53.34 99.19,52.96 100.46,52.96 v101.6,51.82
ETXD3  (via drill 0.3, 0.4)
  Top 0.254: 78.23,25.65 78.87,26.29 79.38,26.29 v80.14,27.05 | U8.22 101.63,49.88 101.47,50.04 101.47,50.67 v100.58,51.56
  Top 0.508: A20-SOM-EVB_PLATFORM.2-30 78.11,25.53 78.23,25.65
  Bottom 0.254: v80.14,27.05 80.64,27.56 80.64,37.59 82.68,39.62 87.12,39.62 87.38,39.88 87.38,40.39 87.63,40.64 88.01,40.64 88.27,40.39 88.27,39.88 88.52,39.62 89.03,39.62 89.28,39.88 89.28,41.02 89.53,41.27 89.92,41.27 90.17,41.02 90.17,40.26 90.42,40.01 90.81,40.01 91.82,41.02 91.82,41.78 91.57,42.04 91.06,42.04 90.81,42.29 90.81,42.55 91.06,42.8 91.57,42.8 91.82,43.05 91.82,49.15 95.5,52.83 98.55,52.83 98.93,52.45 99.69,52.45 v100.58,51.56
ETXEN  (via drill 0.3, 0.4)
  Top 0.254: 79.63,25.65 80.26,26.29 80.77,26.29 v81.15,26.67 | U8.25 99.44,48.34 99.44,49.4 99.19,49.66 98.17,49.66 97.92,49.91 v97.92,52.07
  Top 0.508: A20-SOM-EVB_PLATFORM.2-32 79.38,25.4 79.63,25.65
  Bottom 0.254: v81.15,26.67 81.15,37.34 82.93,39.12 86.11,39.12 86.36,38.86 86.36,37.34 86.61,37.08 86.87,37.08 87.12,37.34 87.12,38.86 87.38,39.12 87.63,39.12 87.88,38.86 87.88,37.34 88.14,37.08 88.39,37.08 88.65,37.34 88.65,38.86 88.9,39.12 89.41,39.12 89.79,39.5 91.95,39.5 92.33,39.88 92.33,48.9 95.5,52.07 v97.92,52.07
GND  (via drill 0.4, 0.5, 0.6)
  Top 0.203: CAM1.2 2.71,78.83 3.05,78.49 | 6.14,78.83 CAM1.1 | CAM1.24 1.36,83.23 1.02,83.57 | CAM1.23 7.66,83.23 8.64,84.2 11.05,84.2 | CAM1.15 11.39,81.63 11.56,81.79
  Top 0.254: HDMI.17 127.83,21.27 127.89,21.21 | HDMI.11 127.75,24.27 127.89,24.13 | HDMI.8 127.78,25.77 127.89,25.65 | HDMI.5 127.8,27.27 127.89,27.18 | HDMI.2 127.83,28.77 127.89,28.7 | 6.14,78.83 5.84,79.12 5.21,79.12 v4.32,80.01 | v2.67,76.96 3.05,77.34 3.05,78.49 | 26.67,71.88 26.54,71.75 25.78,71.75 25.27,71.25 v25.27,70.23 | U8.29 102.63,46.34 U8.N1 | v110.11,40.39 111.12,39.37 111.12,36.7 111.76,36.07 v111.76,34.16 | v46.74,91.44 46.74,90.17 30.61,90.17 v30.61,86.23
  Top 0.381: v119.63,31.5 119.51,31.37 U4.8 U4.3 | v119.63,28.19 119.51,28.32 U5.8 U5.3 | U6.3 U6.8 119.76,25.27 v120.4,24.64 | 0.57,89.66 0.57,91.82
  Top 0.508: U1.2 19.68,32.77 C2.2 | R2.1 21.46,30.61 22.1,31.24 22.1,32.77 | 22.1,32.77 v22.1,34.42 | 18.8,21.46 U2.2 | C16.2 19.05,27.05 19.81,27.81 U3.2 24.13,27.81 24.26,27.94 25.15,27.94 C14.2 | 1.02,83.57 1.02,84.58 2.54,86.11 2.54,86.74 | C30.2 23.24,73.66 27.94,73.66 28.19,73.41 | VR2.2 26.67,71.88 27.56,71.88 C31.2 | 12.32,84.2 11.05,84.2 | 11.56,81.79 12.32,82.55 12.32,84.2 | 6.48,86.28 6.68,86.49 11.3,86.49 12.32,85.47 12.32,84.2 | 22.1,32.77 24.51,32.77 C1.2 | USB_OTG.GND 9.09,27.86 L2.1 | C34.1 111.12,42.29 v110.24,42.29 | 112.27,52.45 112.27,50.93 111.63,50.29 | v9.78,48.01 9.78,47.88 12.19,47.88 13.08,46.99 16.76,46.99 | R35.2 v9.91,89.41
  Top 0.584: U14.5 9.65,90.55 R35.2
  Top 0.61: 10.79,100.58 R34.2 | 10.79,100.58 v10.79,101.47 | 9.91,100.58 10.79,100.58 | R37.2 7.37,97.66 7.37,101.35 7.62,101.6 9.91,101.6 9.91,100.58 | 9.91,100.58 R36.2
  Top 0.762: R28.2 121.03,18.92 123.32,18.92 124.78,17.46 125.6,17.46 | R8.1 22.1,22.86 21.21,23.75 R10.1 | 15.49,62.36 15.62,62.48 19.81,62.48 | VR1.2 20.07,63.75 19.81,63.5 19.81,62.48 | 19.81,62.48 19.81,62.36 C29.2 | C26.2 10.03,72.64 8.64,71.25 v8.64,68.2 | v104.65,54.86 105.41,54.1 C35.1 C74.1 | C37.1 99.19,54.86 v100.2,54.86 | v110.11,40.39 109.35,40.39 R52.1 | C55.1 97.54,38.61 v97.54,39.37 97.54,40.13 C43.1 | C65.1 C58.1 104.01,34.16 | C53.1 112.27,52.45 112.39,52.58 v112.39,53.72 | C42.2 90.55,37.34 v90.55,38.1 90.55,38.86 R29.2 | A20-SOM-EVB_PLATFORM.3-4 88.27,76.45 v87,76.45
  Top 1.016: A20-SOM-EVB_PLATFORM.1-2 33.66,25.78 32.51,26.92 32.51,32.13 34.16,33.78 v39.62,33.78 | R4.1 R3.1 | R4.1 C2.2 | R10.1 R11.1 C13.2 C16.2 v17.65,27.05 C15.2 | LCD_CON.4 78.74,13.21 76.2,13.21 | 76.2,13.21 76.2,11.43 77.47,10.16 v77.47,5.97 | 76.2,13.21 LCD_CON.2 | A20-SOM-EVB_PLATFORM.2-2 60.33,25.4 61.59,25.4 | 61.59,25.4 A20-SOM-EVB_PLATFORM.2-4 | 61.59,25.4 61.59,26.67 62.23,27.3 62.23,28.32 66.29,32.38 67.31,32.38 69.47,34.54 v77.98,34.54 77.98,34.67 | 31.75,86.23 GPIO-4.4 | 31.75,86.23 v30.61,86.23 29.21,86.23 GPIO-4.2 | 31.75,86.23 31.75,85.6 33.02,84.33 v33.02,80.9 33.02,74.42 | UEXT2.2 29.21,101.6 v27.3,101.6 | UEXT1.2 49.53,101.6 v50.8,101.6 | A20-SOM-EVB_PLATFORM.4-2 60.33,78.11 60.96,78.74 60.96,84.45 59.69,85.72 GPIO-4.26 59.69,88.77 62.74,88.77 63.75,89.79 70.61,89.79 | v87,76.45 A20-SOM-EVB_PLATFORM.3-2 | 125.09,67.18 VGA_DB15-F.GND1 120.57,61.8 117.28,65.09 FET4.2 | 125.09,67.18 128.14,67.18 129.67,68.71 129.67,80.14 | 125.09,67.18 125.09,69.34 | 125.09,69.34 VGA_DB15-F.10 | VGA_DB15-F.5 122.69,69.34 125.09,69.34 | VGA_DB15-F.8 VGA_DB15-F.7 VGA_DB15-F.6 125.47,80.14 129.67,80.14 | 77.98,34.67 80.77,34.67 | 87.5,34.67 v87.5,34.42 v89.15,34.42 v90.55,34.42 | FET5.2 117.2,75.44 v118.11,75.44 | C10.2 v17.65,22.23 C11.2 18.8,21.46 C9.2 R9.1 18.8,18.92 17.78,17.91 GPIO-1.2 17.78,12.45 16.38,11.05 v16.38,10.03 16.38,4.06 C69.- | C14.2 25.91,26.42 v25.15,25.65 C12.2 | L2.1 9.91,27.43 10.92,28.45 L8.1 v13.08,28.45 C5.2 13.08,31.88 | 3.17,44.12 3.17,47.55 3.56,47.93 SATA.7 6.28,47.93 6.6,48.26 9.53,48.26 v9.78,48.01 | 3.17,44.12 3.17,40.7 3.56,40.31 SATA.1 6.29,40.31 6.6,40.01 9.14,40.01 13.08,36.07 C3.2 C4.2 13.08,31.88